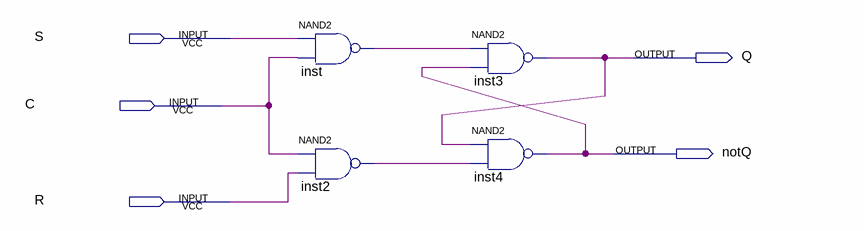
[diagram p0: schematic sheet]
// Quartus schematic flip-flop-rs.bdf as structural Verilog: 4 symbols, 5 pins
module \flip-flop-rs  (
  input  S,
  input  C,
  input  R,
  output Q,
  output notQ
);

  wire inst2_out, inst_out;

  nand inst (inst_out, S, C);
  nand inst2 (inst2_out, C, R);
  nand inst3 (Q, inst_out, notQ);
  nand inst4 (notQ, Q, inst2_out);
endmodule
